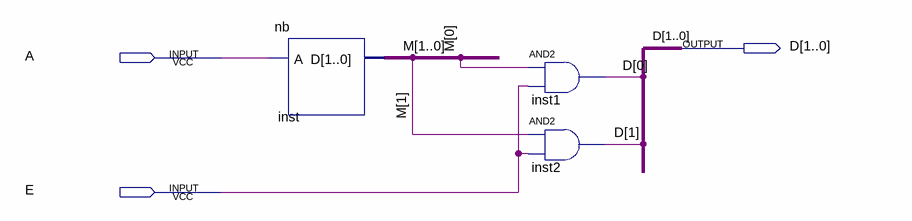
[diagram p0: schematic sheet]
// Quartus schematic nbe.bdf as structural Verilog: 3 symbols, 3 pins
module nbe (
  input  A,
  input  E,
  output [1:0] D
);

  wire [1:0] M;

  nb inst (.A(A), .D(M));
  and inst1 (D[0], M[0], E);
  and inst2 (D[1], M[1], E);
endmodule
